# Altium project ece315-S20.PrjPcb
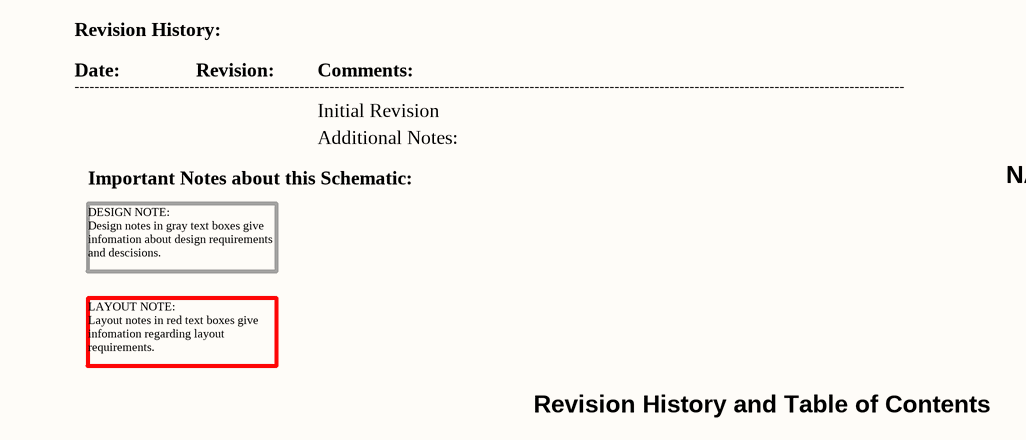
[diagram p0: 01-Revision_History_and_Contents.SchDoc]
9 sheets, 148 parts. Net scope: global (net labels, ports and power ports of the same name join across sheets).
Board file: ECE315_S20.PcbDoc
Sheets:
  01-Revision_History_and_Contents.SchDoc
  02-Power.SchDoc
  03_MCU.SchDoc
  04_LEDs.SchDoc
  05_LEDs.SchDoc
  06_LEDs.SchDoc
  07_Buzzer.SchDoc
  08_USB_To_UART.SchDoc
  09_Mechanicals.SchDoc

## Sheet 01-Revision_History_and_Contents.SchDoc: Revision History and Contents
size A; Date: 4/25/2017; ApprovedBy: JSK; CheckedBy: JSK; Author: JSK; CompanyName: University of Wisconsin; DrawnBy: JSK; Engineer: JSK; Organization: ECE 315; Address1: College of Engineering; Address2: 1415 Engineering Drive; Address3: Madison, WI 53706; Address4: ECE 453 Spring 2017; Revision: A; SheetNumber: 1; SheetTotal: 2

### Notes on the sheet
- Revision History:
- Date:
- ----------------------------------------------------------------------------------------------------------------------------------------------------------------------
- Revision:
- Comments:
- Initial Revision
- Important Notes about this Schematic:
- Additional Notes:
- NAME: Albert Liu
- DESIGN NOTE:
  Design notes in gray text boxes give infomation about design requirements and descisions.
- LAYOUT NOTE:
  Layout notes in red text boxes give infomation regarding layout requirements.
- Revision History and Table of Contents

## Sheet 02-Power.SchDoc: ECE315 Analog
size A; Date: 4/25/2017; ApprovedBy: JSK; CheckedBy: JSK; Author: JSK; CompanyName: University of Wisconsin; DrawnBy: JSK; Engineer: JSK; Organization: ECE 315; Address1: College of Engineering; Address2: 1415 Engineering Drive; Address3: Madison, WI 53706; Address4: ECE 315 Fall 2017; Revision: A; SheetNumber: 2; SheetTotal: 2; AssemblyNumber: ECE315-F19; ApprovedDate: 04/02/2019
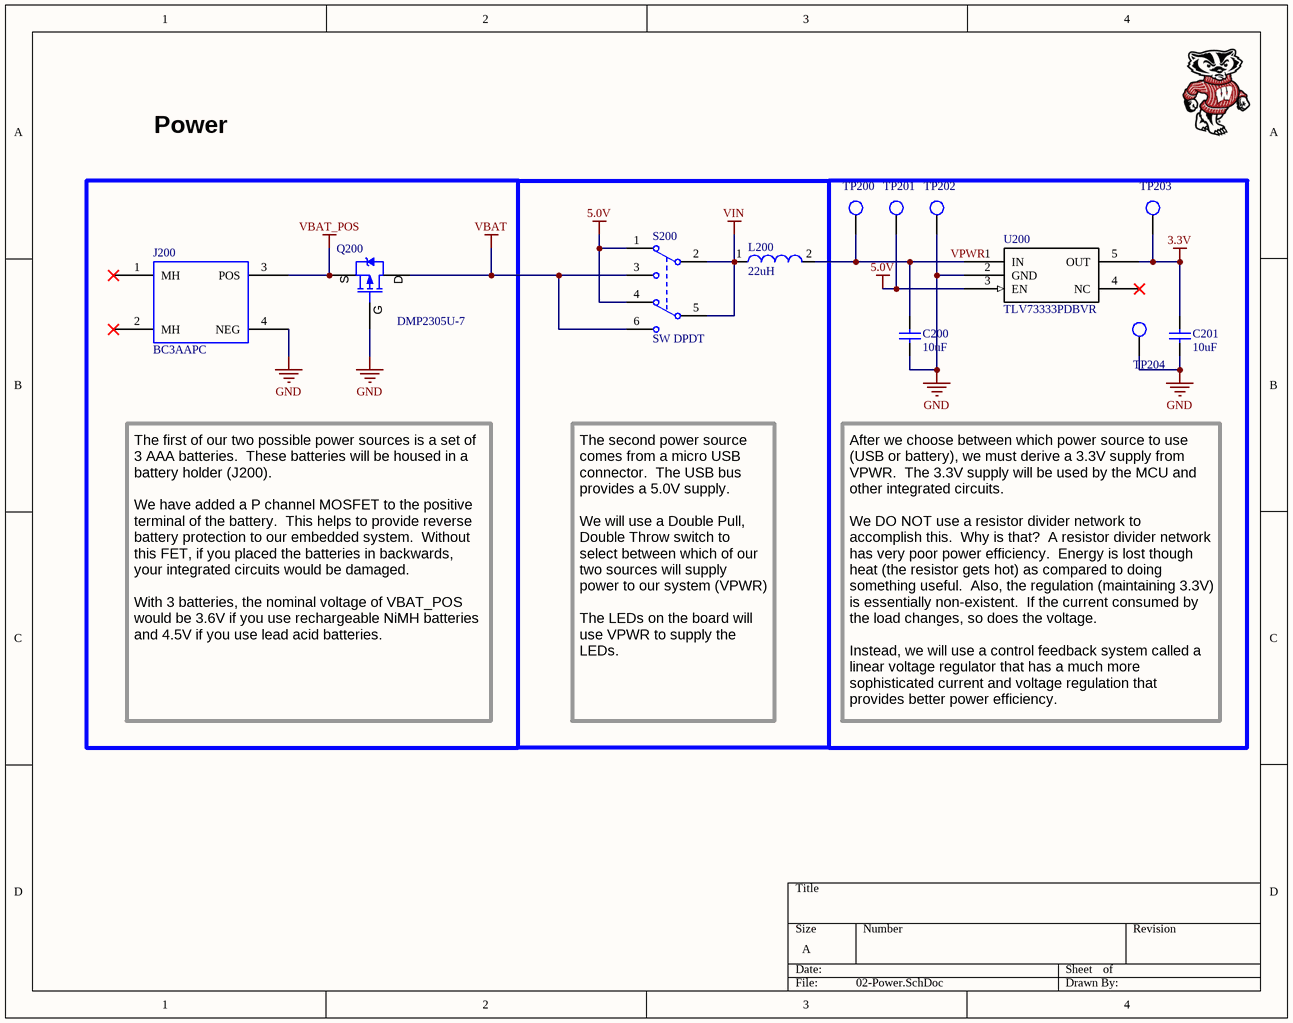
[diagram p1: 02-Power.SchDoc]

### Parts
C200  10uF  [CAP_0805]
C201  10uF  [CAP_0805]
J200  BC3AAPC  [BC3AAPC]
L200  Inductance: 22uH  [SRN3015]  (hidden comment: SRN3015-220M)
Q200  Manufacturer Part Number: DMP2305U-7  [SOT23]  (hidden comment: PMOS-DMP2305U-7)
S200  SW DPDT  [DPDT]
TP200  TP_1206  [TP-SMC-1206]  (value not drawn)
TP201  TP_1206  [TP-SMC-1206]  (value not drawn)
TP202  TP_1206  [TP-SMC-1206]  (value not drawn)
TP203  TP_1206  [TP-SMC-1206]  (value not drawn)
TP204  TP_1206  [TP-SMC-1206]  (value not drawn)
U200  Manufacturer Part Number: TLV73333PDBVR  [IC_TLV73333]  (hidden comment: IC-TLV733P)

### Nets
3.3V: C201.2 TP203.1 U200.5(OUT)
5.0V: S200.1(NC1) S200.4(NC2) TP201.1 U200.3(EN)
GND: C200.1 C201.1 J200.4(NEG) Q200.1(G) TP202.1 TP204.1 U200.2(GND)
VBAT: Q200.3(D) S200.3(NO1) S200.6(NO2)
VBAT_POS: J200.3(POS) Q200.2(S)
VIN: L200.1 S200.2(COMMON1) S200.5(COMMON2)
VPWR: C200.2 L200.2 TP200.1 U200.1(IN)

Not connected (* = marked no-connect by the designer): J200 1(MH)* 2(MH)*; U200 4(NC)*

### Notes on the sheet
- Power
- The first of our two possible power sources is a set of 3 AAA batteries.  These batteries will be housed in a battery holder (J200).
  We have added a P channel MOSFET to the positive terminal of the battery.  This helps to provide reverse battery protection to our embedded system.  Without this FET, if you placed the batteries in backwards, your integrated circuits would be damaged.
  With 3 batteries, the nominal voltage of VBAT_POS would be 3.6V if you use rechargeable NiMH batteries and 4.5V if you use lead acid batteries.
- The second power source comes from a micro USB connector.  The USB bus provides a 5.0V supply.
  We will use a Double Pull, Double Throw switch to select between which of our two sources will supply power to our system (VPWR)
  The LEDs on the board will use VPWR to supply the LEDs.
- After we choose between which power source to use (USB or battery), we must derive a 3.3V supply from VPWR.  The 3.3V supply will be used by the MCU and other integrated circuits.
  We DO NOT use a resistor divider network to accomplish this.  Why is that?  A resistor divider network has very poor power efficiency.  Energy is lost though heat (the resistor gets hot) as compared to doing something useful.  Also, the regulation (maintaining 3.3V) is essentially non-existent.  If the current consumed by the load changes, so does the voltage.
  Instead, we will use a control feedback system called a linear voltage regulator that has a much more sophisticated current and voltage regulation that provides better power efficiency.

### Library data of the parts
C200 C201 = CAP_0805_U_010.00: CAP CER 10UF 16V X7R 0805; Manufacturer: Samsung; Manufacturer Part Number: CL21A106KPCLQNC; Tolerance: 10%; Voltage Rating: 10V; Dielectric: X5R; ComponentLink3URL: https://datasheet.ciiva.com/26920/getdatasheetpartid-355170-26920201.pdf; ComponentLink3Description: https://datasheet.ciiva.com/26920/getdatasheetpartid-355170-26920201.pdf; Supplier 1: Digi-Key; Stock 1: 40000; Pricing 1: 1=0.22, 10=0.148, 100=0.0749, 500=0.05122, 1000=0.04531 (USD); Mount: Surface Mount; Case/Package: 0805; Case Code (Metric): 2012; Case Code (Imperial): 0805; Contact Plating: Tin; Min Operating Temperature: -55°C; Max Operating Temperature: 85°C; Packaging: Tape and Reel; Package Quantity: 1; Length: 2mm; Height: 0.85mm; Width: 0.049inch; Thickness: 0.037inch; Depth: 1.25mm; Radiation Hardening: No; ComponentLink1URL: https://datasheet.ciiva.com/25730/cl21a106kpclqnc-25730594.pdf; ComponentLink1Description: https://datasheet.ciiva.com/25730/cl21a106kpclqnc-25730594.pdf; Supplier Part Number 1: 1276-2402-1-ND; Capacitance: 10uF
J200 = BC3AAPC: BATTERY HOLDER AA 3 CELL PC PIN; Manufacturer: Memory Protection Devices; Number of Cells: 3; Package Quantity: 100; Termination: PC Pin; Min Operating Temperature: -10°C; Supplier: Digi-Key; Max Operating Temperature: 100°C; Mount: Through Hole,PCB; ComponentLink1URL: http://www.memoryprotectiondevices.com/datasheets/BC3AAPC-datasheet.pdf?src-supplier=Digi-Key; ComponentLink1Description: http://www.memoryprotectiondevices.com/datasheets/BC3AAPC-datasheet.pdf?src-supplier=Digi-Key; Supplier Part Number: BC3AAPC-ND; Manufacturer Part Number: BC3AAPC
L200 = SRN3015-220M: 22uH 3x3mm sheilded inductor 600mA; Manufacturer 1: Bourns; Core Material: Ferrite; Saturation Current: 580mA; Tolerance: 20%; Shielding: Shielded; Self Resonant Frequency: 28MHz; DC Resistance (DCR): 622mR; Test Frequency: 1MHz; Supplier 1: Digi-Key; Stock 1: 46536; Pricing 1: 1=0.46000, 10=0.40300, 100=0.28750, 500=0.24150, 1000=0.19550 (USD); RoHS: Yes; Case/Package: 1212; Number of Pins: 2; Weight: 0.001235oz; Contact Plating: Tin; Min Operating Temperature: -40°C; Max Operating Temperature: 125°C; Package Quantity: 2000; Inductance Tolerance: 20%; Packaging: Tape and Reel; Current Rating: 600mA; Composition: Wirewound; Max DC Current: 600mA; Termination: SMD/SMT; DC Current: 600mA; Military Standard: Not; RMS Current (Irms): 600mA; Length: 3.1mm; Height: 1.5mm; Width: 0.118inch; Height - Seated (Max): 0.059inch; Depth: 3.1mm; REACH SVHC: No SVHC; ComponentLink1URL: https://datasheet.ciiva.com/11802/0900766b80fe1f40-11802602.pdf?src-supplier=RSComponents; ComponentLink1Description: https://datasheet.ciiva.com/11802/0900766b80fe1f40-11802602.pdf?src-supplier=RSComponents; ComponentLink2URL: https://datasheet.ciiva.com/1048/srn3015-1048848.pdf?src-supplier=Digi-Key; ComponentLink2Description: https://datasheet.ciiva.com/1048/srn3015-1048848.pdf?src-supplier=Digi-Key; ComponentLink3URL: https://datasheet.ciiva.com/1048/srn3015-1048849.pdf?src-supplier=Digi-Key; ComponentLink3Description: https://datasheet.ciiva.com/1048/srn3015-1048849.pdf?src-supplier=Digi-Key; ComponentLink4URL: https://datasheet.ciiva.com/1048/srn3015-1048850.pdf?src-supplier=Digi-Key; ComponentLink4Description: https://datasheet.ciiva.com/1048/srn3015-1048850.pdf?src-supplier=Digi-Key; ComponentLink5URL: https://datasheet.ciiva.com/30089/587srn3015-30089590.pdf?src-supplier=Onlinecomponents.com; ComponentLink5Description: https://datasheet.ciiva.com/30089/587srn3015-30089590.pdf?src-supplier=Onlinecomponents.com; ComponentLink6URL: https://datasheet.ciiva.com/7849/1481208-7849511.pdf?src-supplier=Element14; ComponentLink6Description: https://datasheet.ciiva.com/7849/1481208-7849511.pdf?src-supplier=Element14; ComponentLink7URL: https://datasheet.ciiva.com/22678/1875284-22678991.pdf?src-supplier=Element14; ComponentLink7Description: https://datasheet.ciiva.com/22678/1875284-22678991.pdf?src-supplier=Element14; Manufacturer Part Number 1: SRN3015-220M; Supplier Part Number 1: SRN3015-220MCT-ND
Q200 = PMOS-DMP2305U-7: MOSFET P-CH 20V 4.2A SOT-23; Manufacturer: Diodes Zetex; Turn-Off Delay Time: 53.8ns; Drain to Source Breakdown Voltage: -20V; Number of Channels: 1; On-State Resistance: 60mR; Power Dissipation: 1.4W; Input Capacitance: 727pF; Turn-On Delay Time: 14ns; Rise Time: 13ns; Gate to Source Voltage (Vgs): 8V; Element Configuration: Single; Threshold Voltage: -500mV; ComponentLink1Description: Manufacturer Link; ComponentLink1URL: http://www.irf.com/; ComponentLink2URL: http://www.diodes.com/_files/datasheets/ds30149.pdf?src-supplier=Future+Electronics; ComponentLink2Description: http://www.diodes.com/_files/datasheets/ds30149.pdf?src-supplier=Future+Electronics; ComponentLink3URL: http://www.diodes.com/datasheets/ds31737.pdf?src-supplier=Avnet+Asia; ComponentLink3Description: http://www.diodes.com/datasheets/ds31737.pdf?src-supplier=Avnet+Asia; Contact Plating: Tin,Matte; Weight: 0.000282oz; Continuous Drain Current (ID): 4.2A; Min Operating Temperature: -55°C; Number of Elements: 1; Mount: Surface Mount; Number of Pins: 3; REACH SVHC: No SVHC; Radiation Hardening: No; Length: 2.9mm; Drain to Source Voltage (Vdss): 20V; Case/Package: SOT-23; Rds On Max: 60mR; Lead Free: Lead Free; Packaging: Tape and Reel; Fall Time: 13ns; Max Power Dissipation: 1.4W; Drain to Source Resistance: 60mR; Max Operating Temperature: 150°C; Width: 1.3mm; Package Quantity: 3000; Supplier: Digi-Key; Height: 1mm; Supplier Part Number: DMP2305UDICT-ND
S200 = SW DPDT: Switch; Manufacturer: ITT /  C&K Components; Manufacturer Part Number: JS202011SCQN; Actuator Color: Black; Maximum DC Voltage Rating: 6 V; Actuator Material: Nylon 4/6; Electrical Life: 15000 Cycles; Body Orientation: Straight; Maximum Contact Resistance: 70 mOhm; Actuator Style: Top Slide; Dielectric Strength: 500 VAC; Minimum Insulation Resistance: 100 MOhm; Contact Rating @ Voltage: 0.3@6VDC A; COO: US; Published: 24-Mar-1999; LatestRevisionDate: 29-May-2009; LatestRevisionNote: IPC-7351 Footprint Added.; PackageVersion: Mar-2001; PackageReference: SOT23-6; Publisher: Altium Limited; PackageDescription: 6-Pin SOT-23 Package 0.95 mm Pitch, 2.7 mm Lead Span; Code_JEITA: SC-74; Code_IPC: SOT26A-6; Supplier 1: C&K Components; Stock 1: 22661; Pricing 1: 1=0.46, 10=0.441, 25=0.4316, 50=0.3858, 100=0.3674, 250=0.3582, 500=0.3031 (USD); Part No: JS202011SCQN; RoHS: Yes; Supplier Standard Pack: 5,000; Type: Sub-Miniature; Maximum AC Voltage Rating: N/A; Family: JS; Contact Material: Copper Alloy; Seal Description: N/A; Pole Throw Configuration: DPDT; Mechanical Life: N/A; Packaging: Tape and Reel; Contact Plating: Silver; Switch Configuration: N/A; Housing Material: Nylon 4/6; Product Weight: N/A; Base Material: N/A; Mounting: Surface Mount,Gull Wing; Seal Location: N/A; Operating Temperature: -40 to 85 C; Dimension: 9 x 7.5 x 5.5 mm; HTS: 8536509050; ECCN: EAR99; ComponentLink1URL: https://datasheet.ciiva.com/23829/1707718-23829488.pdf; ComponentLink1Description: https://datasheet.ciiva.com/23829/1707718-23829488.pdf; ComponentLink2URL: https://datasheet.ciiva.com/2889/js-29aug13-2889127.pdf; ComponentLink2Description: https://datasheet.ciiva.com/2889/js-29aug13-2889127.pdf; ComponentLink3URL: https://datasheet.ciiva.com/2889/js-15sept15-2889128.pdf; ComponentLink3Description: https://datasheet.ciiva.com/2889/js-15sept15-2889128.pdf; ComponentLink4URL: https://datasheet.ciiva.com/2889/js-15sept15-2889129.pdf; ComponentLink4Description: https://datasheet.ciiva.com/2889/js-15sept15-2889129.pdf; ComponentLink5URL: https://datasheet.ciiva.com/22630/1707718-22630697.pdf; ComponentLink5Description: https://datasheet.ciiva.com/22630/1707718-22630697.pdf; ComponentLink6URL: https://datasheet.ciiva.com/8625/js-9dec14-8625470.pdf; ComponentLink6Description: https://datasheet.ciiva.com/8625/js-9dec14-8625470.pdf; Supplier Part Number 1: 401-2002-1-ND
TP200-TP204 = TP_1206: Test Point SMD 1206; Manufacturer: TE Connectivity (Tyco Electronics); Manufacturer Part Number: 1625854-1; Resistance Value: 0 Ohm; Temperature Coefficient: N/R; Supplier 1: Digi-Key; Stock 1: 31937; Pricing 1: 1=0.28, 10=0.261, 25=0.224, 50=0.1902, 100=0.1828, 250=0.1641, 500=0.1567, 1000=0.1306 (USD); Case Size: 1206; Dimension: 3.2 x 1.6 x 1.25mm; Family: RC; Mounting: Surface Mount; Operating Temperature: -55 to 125 C; Part No: 1625854-1; RoHS: Yes; Packaging: Tape and Reel; Termination Style: N/R; Terminal Pitch: N/R; Power Rating: N/R; Tolerance: N/R; ComponentLink1URL: https://datasheet.ciiva.com/6439/eng-ds-1773266-a-6439169.pdf; ComponentLink1Description: https://datasheet.ciiva.com/6439/eng-ds-1773266-a-6439169.pdf; ComponentLink2URL: https://datasheet.ciiva.com/30136/1773266-a-30136341.pdf; ComponentLink2Description: https://datasheet.ciiva.com/30136/1773266-a-30136341.pdf; ComponentLink3URL: https://datasheet.ciiva.com/6439/eng-ds-1773266-a-6439080.pdf; ComponentLink3Description: https://datasheet.ciiva.com/6439/eng-ds-1773266-a-6439080.pdf; ComponentLink4URL: https://datasheet.ciiva.com/6439/eng-ds-1773266-a-6439081.pdf; ComponentLink4Description: https://datasheet.ciiva.com/6439/eng-ds-1773266-a-6439081.pdf; ComponentLink5URL: https://datasheet.ciiva.com/6439/eng-ds-1773266-a-6439083.pdf; ComponentLink5Description: https://datasheet.ciiva.com/6439/eng-ds-1773266-a-6439083.pdf; Supplier Part Number 1: A106143CT-ND
U200 = IC-TLV733P: IC REG LINEAR 3.3V 300MA SOT23-5; Manufacturer: Texas Instruments; Number of Outputs: 1; Min Input Voltage: 1.4V; Max Input Voltage: 5.5V; Dropout Voltage: 125mV; Min Current Limit: 360mA; Polarity: Positive; Quiescent Current: 60uA; Accuracy: 1%; Supplier 1: Digi-Key; Stock 1: 44968; Pricing 1: 1=0.46, 10=0.373, 100=0.2538, 500=0.19034, 1000=0.14276 (USD); Mount: Surface Mount; Case/Package: SOT-23-5; Number of Pins: 5; Weight: 0.000557oz; Contact Plating: Nickel,Gold; Min Operating Temperature: -40°C; Max Operating Temperature: 125°C; Packaging: Tape and Reel; Max Output Current: 300mA; Output Voltage: 3.3V; Output Current: 300mA; Number of Regulators: 1; Package Quantity: 3000; Radiation Hardening: No; Lead Free: Lead Free; ComponentLink1URL: https://datasheet.ciiva.com/48677/tlv733p-48677542.pdf; ComponentLink1Description: https://datasheet.ciiva.com/48677/tlv733p-48677542.pdf; Supplier Part Number 1: 296-40673-1-ND

## Sheet 03_MCU.SchDoc: ECE315 MCU
size A; Date: 4/25/2017; ApprovedBy: JSK; CheckedBy: JSK; Author: JSK; CompanyName: University of Wisconsin; DrawnBy: JSK; Engineer: JSK; Organization: ECE 315; Address1: College of Engineering; Address2: 1415 Engineering Drive; Address3: Madison, WI 53706; Address4: ECE 315 Fall 2017; Revision: A; SheetNumber: 3; SheetTotal: 6; AssemblyNumber: ECE315-F19; ApprovedDate: 04/02/2019
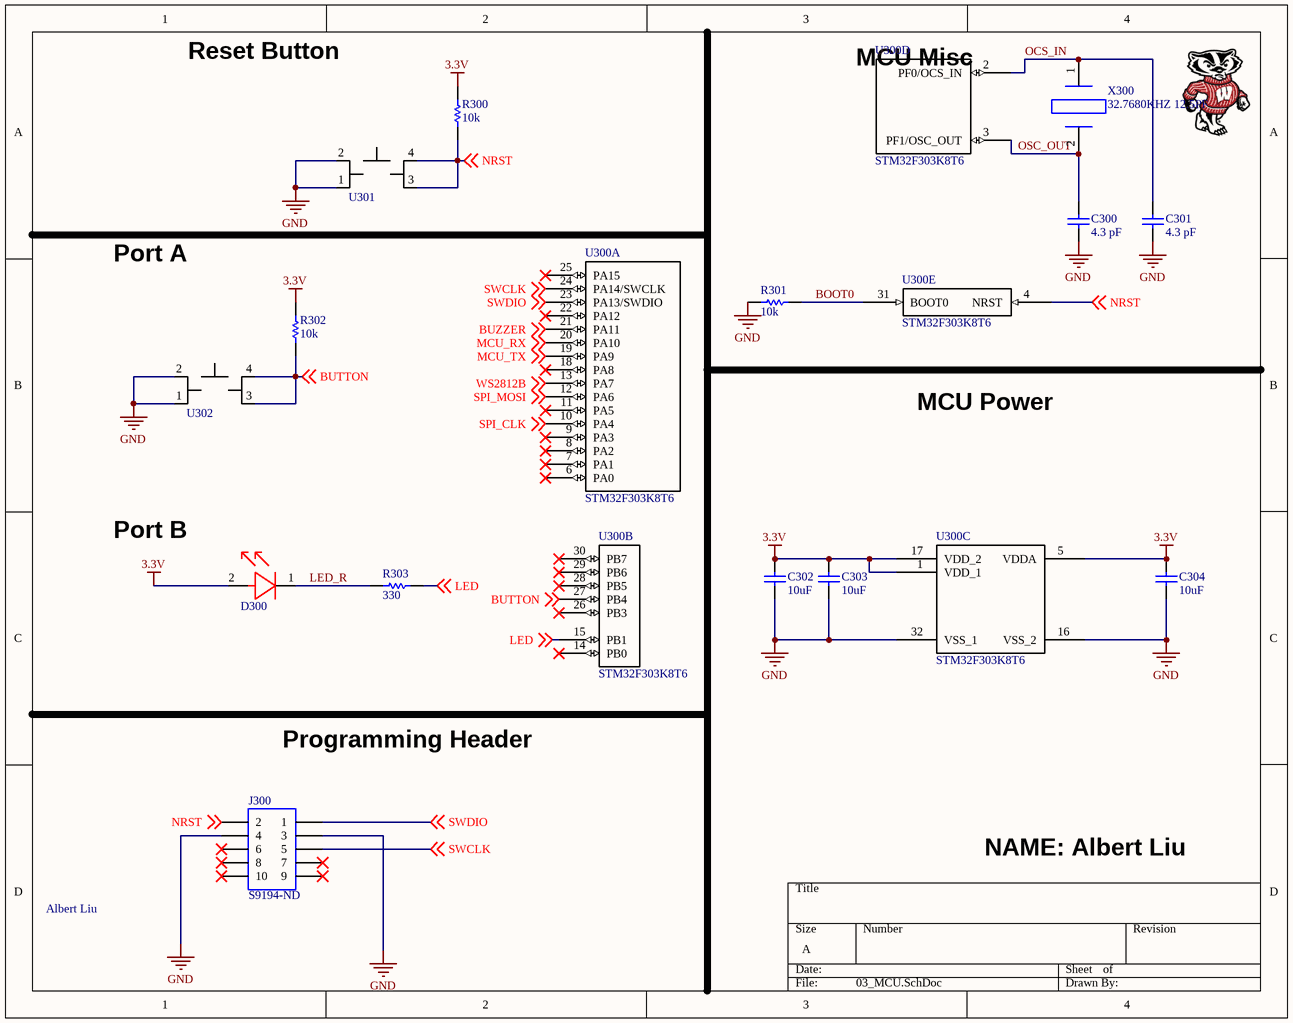
[diagram p2: 03_MCU.SchDoc]

### Parts
C300  Capacitance Value: 4.3 pF  [CAP_0805]  (hidden comment: CAP_0805_P_004.30)
C301  Capacitance Value: 4.3 pF  [CAP_0805]  (hidden comment: CAP_0805_P_004.30)
C302  10uF  [CAP_0805]
C303  10uF  [CAP_0805]
C304  10uF  [CAP_0805]
D300  LED_RED_0805.1  [LED_RED_0805]  (value not drawn)
J300  Supplier Part Number 1: S9194-ND  [SFH11-PBPC-D05-ST-BK]  (hidden comment: SFH11-PBPC-D05-ST-BK)
R300  10K  [RES_0805]
R301  10K  [RES_0805]
R302  10K  [RES_0805]
R303  330  [RES_0805]
U300  Manufacturer Part Number: STM32F303K8T6  [LQFP32]  (hidden comment: IC_STM32F303K8T6)  (parts A,B,C,D,E of 5)
U301  SWITCH_6mm_6mm_smd  [SWITCH_6mm_6mm_smd]  (value not drawn)
U302  SWITCH_6mm_6mm_smd  [SWITCH_6mm_6mm_smd]  (value not drawn)
X300  32.7680KHZ 12.5PF  [NX3215SA-32.768K-STD-MUA-8]

### Nets
3.3V: C302.2 C303.2 C304.2 D300.2(Anode) R300.2 R302.2 U300.1(VDD_1) U300.5(VDDA) U300.17(VDD_2)
GND: C300.1 C301.1 C302.1 C303.1 C304.1 J300.3 J300.4 R301.1 U300.16(VSS_2) U300.32(VSS_1) U301.1 U301.2 U302.1 U302.2
BOOT0: R301.2 U300.31(BOOT0)
BUTTON: R302.1 U300.27(PB4) U302.3 U302.4(VCCIO) ; off-sheet BUTTON
BUZZER: U300.21(PA11) ; off-sheet BUZZER
LED: R303.2 U300.15(PB1) ; off-sheet LED
LED_R: D300.1(Cathode) R303.1
MCU_RX: U300.20(PA10) ; off-sheet MCU_RX
MCU_TX: U300.19(PA9) ; off-sheet MCU_TX
NRST: J300.2 R300.1 U300.4(NRST) U301.3 U301.4(VCCIO) ; off-sheet NRST
OCS_IN: C301.2 U300.2(PF0/OCS_IN) X300.1
OSC_OUT: C300.2 U300.3(PF1/OSC_OUT) X300.2
SPI_CLK: U300.10(PA4) ; off-sheet SPI_CLK
SPI_MOSI: U300.12(PA6) ; off-sheet SPI_MOSI
SWCLK: J300.5 U300.24(PA14/SWCLK) ; off-sheet SWCLK
SWDIO: J300.1 U300.23(PA13/SWDIO) ; off-sheet SWDIO
WS2812B: U300.13(PA7) ; off-sheet WS2812B

Not connected (* = marked no-connect by the designer): J300 6* 7* 8* 9* 10*; U300 6(PA0)* 7(PA1)* 8(PA2)* 9(PA3)* 11(PA5)* 14(PB0)* 18(PA8)* 22(PA12)* 25(PA15)* 26(PB3)* 28(PB5)* 29(PB6)* 30(PB7)*

### Notes on the sheet
- Reset Button
- MCU Misc
- Port A
- MCU Power
- Port B
- Programming Header
- Albert Liu
- NAME: Albert Liu

### Library data of the parts
C300 C301 = CAP_0805_P_004.30: CAP CER 4.3PF 100V NP0 0805; Manufacturer: Kyocera AVX; Manufacturer Part Number: 08051A4R3CAT2A; Rad Hard: No; Voltage: 100 Vdc; Tolerance: 0.25 pF; Dielectric: C0G; Product Length: 2.01 mm; Product Depth: 1.25 mm; Supplier 1: Digi-Key; Stock 1: 23910; Pricing 1: 1=0.24, 10=0.167, 100=0.0946, 500=0.0668, 1000=0.0584 (USD); Packaging: Tape & Reel; Package/Case: 0805; Mounting: Surface Mount; Operating Temperature: -55 to 125 °C; Construction: Flat; Category: Capacitor Ceramic Multilayer; ComponentLink1URL: https://datasheet.ciiva.com/204/ccog-204944.pdf; ComponentLink1Description: https://datasheet.ciiva.com/204/ccog-204944.pdf; ComponentLink2URL: https://datasheet.ciiva.com/11570/ccog-11570969.pdf; ComponentLink2Description: https://datasheet.ciiva.com/11570/ccog-11570969.pdf; Supplier Part Number 1: 478-10404-1-ND
C302-C304 = CAP_0805_U_010.00: as C200 on sheet 02-Power; ComponentLink3URL: https://datasheet.ciiva.com/26920/getdatasheetpartid-355170-26920201.pdf; ComponentLink3Description: https://datasheet.ciiva.com/26920/getdatasheetpartid-355170-26920201.pdf; Supplier 1: Digi-Key; Stock 1: 40000; Pricing 1: 1=0.22, 10=0.148, 100=0.0749, 500=0.05122, 1000=0.04531 (USD); Mount: Surface Mount; Case/Package: 0805; Case Code (Metric): 2012; Case Code (Imperial): 0805; Contact Plating: Tin; Min Operating Temperature: -55°C; Max Operating Temperature: 85°C; Packaging: Tape and Reel; Package Quantity: 1; Length: 2mm; Height: 0.85mm; Width: 0.049inch; Thickness: 0.037inch; Depth: 1.25mm; Radiation Hardening: No; ComponentLink1URL: https://datasheet.ciiva.com/25730/cl21a106kpclqnc-25730594.pdf; ComponentLink1Description: https://datasheet.ciiva.com/25730/cl21a106kpclqnc-25730594.pdf; Supplier Part Number 1: 1276-2402-1-ND; Capacitance: 10uF
D300 = LED_RED_0805.1: LED SUPER RED CLR THIN 0805 SMD; Manufacturer: Vishay / Lite-On; Manufacturer Part Number: LTST-C171KRKT; Chip Material: AlGaInP; DELETED: Compliant; Dominant Wave Length: 631 nm; Forward Current: 30 mA; Forward Voltage: 2.4 V; High Brightness: Yes; Lum Intensity: 54mcd; Main Category: Chip LED; Number of  Elements: 1; Peak Wavelength: 639 nm; Power Dissipation: 75 W; Product Depth (mm): 1.25 mm; Product Height (mm): 0.8 mm; Product Length (mm): 2 mm; Rad Hardened: No; Reverse Voltage: 5 V; Shape Type: Rectangular; Test Current (It): 20 mA; Type: Uni-Color; Viewing Angle: 130 deg; Supplier 1: Digikey; Stock 1: 97347; Pricing 1: 1=0.31, 10=0.225, 25=0.1656, 100=0.1183, 250=0.0804, 500=0.071, 1000=0.0556 (USD); Emitting Color: Red; Lens Dimensions: 1.4x1.25x0.5 mm; Luminous Intensity: 54mcd; Mounting: Surface Mount; Operating Temp Range: -55C to 85C; Operating Temperature Classification: Industrial; Package Type: Chip Led; Packaging: Tape and Reel; Pin Count: 2; ComponentLink1URL: https://datasheet.ciiva.com/2110/s-110-ltst-c171krkt-2110066.pdf; ComponentLink1Description: https://datasheet.ciiva.com/2110/s-110-ltst-c171krkt-2110066.pdf; ComponentLink2URL: https://datasheet.ciiva.com/2110/s-110-ltst-c171krkt-2110067.pdf; ComponentLink2Description: https://datasheet.ciiva.com/2110/s-110-ltst-c171krkt-2110067.pdf; ComponentLink3URL: https://datasheet.ciiva.com/2110/s-110-ltst-c171krkt-2110068.pdf; ComponentLink3Description: https://datasheet.ciiva.com/2110/s-110-ltst-c171krkt-2110068.pdf; ComponentLink4URL: https://datasheet.ciiva.com/12403/lite-on-ltst-c171krkt-187201-12403781.pdf; ComponentLink4Description: https://datasheet.ciiva.com/12403/lite-on-ltst-c171krkt-187201-12403781.pdf; ComponentLink5URL: https://datasheet.ciiva.com/11775/0900766b80dc0299-11775643.pdf; ComponentLink5Description: https://datasheet.ciiva.com/11775/0900766b80dc0299-11775643.pdf; ComponentLink6URL: https://datasheet.ciiva.com/16444/lite-on20ltst-c171krkt-16444779.pdf; ComponentLink6Description: https://datasheet.ciiva.com/16444/lite-on20ltst-c171krkt-16444779.pdf; Supplier Part Number 1: 160-1427-1-ND
J300 = SFH11-PBPC-D05-ST-BK: CONN HDR 10POS 0.1 GOLD PCB; Manufacturer 1: Sullins; Number of Positions: 10; Connector Type: Header; Pitch: 0.1inch; Supplier 1: Digi-Key; Manufacturer Part Number 1: SFH11-PBPC-D05-ST-BK; Stock 1: 26289; Pricing 1: 1=0.66000, 10=0.57600, 100=0.49700, 500=0.40662, 1000=0.36144, 5000=0.32630 (USD); RoHS: Yes; Mount: Through Hole; Color: Black; Contact Plating: Gold; Package Quantity: 1; Number of Rows: 2; Packaging: Tray; Termination: Solder; Row Spacing: 0.1inch; Lead Free: Lead Free; ComponentLink1URL: https://datasheet.ciiva.com/754/sfh11-pxxc-dxx-st-xx11160-c-754555.pdf?src-supplier=Digi-Key; ComponentLink1Description: https://datasheet.ciiva.com/754/sfh11-pxxc-dxx-st-xx11160-c-754555.pdf?src-supplier=Digi-Key
R300-R302 = RES_0805_K_010.00: RES SMD 10K OHM 1% 1/8W 0805; Manufacturer: Panasonic / Panasonic ECG; Manufacturer Part Number: ERJ-6ENF1002V; Power Rating: 125mW; Temperature Coefficient: ± 200ppm/°C; Voltage Rating: 150V; Resistor Element Material: Thick Film; Resistor Case Style: 0805; No. of Pins: 2; Product Range: PANASONIC - ERJ Series; Supplier 1: Digikey; Stock 1: 87; Pricing 1: 1=0.1, 10=0.041, 100=0.0167, 1000=0.0075, 2500=0.0065 (USD); Series: ERJ; Supplier Part Number 1: P10.0KCCT-ND; Resistance: 10k; Resistance Tolerance: ± 1%; Resistor Mounting: SMD; Resistor Element Type: Thick Film; ComponentLink1URL: https://datasheet.ciiva.com/11808/0900766b80f80784-11808080.pdf; ComponentLink1Description: https://datasheet.ciiva.com/11808/0900766b80f80784-11808080.pdf; ComponentLink2URL: https://datasheet.ciiva.com/16514/aoa0000ce2-16514021.pdf; ComponentLink2Description: https://datasheet.ciiva.com/16514/aoa0000ce2-16514021.pdf; ComponentLink3URL: https://datasheet.ciiva.com/27055/1988971-27055733.pdf; ComponentLink3Description: https://datasheet.ciiva.com/27055/1988971-27055733.pdf; ComponentLink4URL: https://datasheet.ciiva.com/16759/70260748-16759350.pdf; ComponentLink4Description: https://datasheet.ciiva.com/16759/70260748-16759350.pdf; ComponentLink5URL: https://datasheet.ciiva.com/16725/70260748-16725031.pdf; ComponentLink5Description: https://datasheet.ciiva.com/16725/70260748-16725031.pdf; ComponentLink6URL: https://datasheet.ciiva.com/7830/426256-7830745.pdf; ComponentLink6Description: https://datasheet.ciiva.com/7830/426256-7830745.pdf; ComponentLink7URL: https://datasheet.ciiva.com/46372/1678782-46372714.pdf; ComponentLink7Description: https://datasheet.ciiva.com/46372/1678782-46372714.pdf; ComponentLink8URL: https://datasheet.ciiva.com/46372/1678782-46372715.pdf; ComponentLink8Description: https://datasheet.ciiva.com/46372/1678782-46372715.pdf; ComponentLink9URL: https://datasheet.ciiva.com/17212/aoa0000ce2-17212108.pdf; ComponentLink9Description: https://datasheet.ciiva.com/17212/aoa0000ce2-17212108.pdf; ComponentLink10URL: https://datasheet.ciiva.com/30140/aoa0000ce2-30140236.pdf; ComponentLink10Description: https://datasheet.ciiva.com/30140/aoa0000ce2-30140236.pdf; ComponentLink11URL: https://datasheet.ciiva.com/16740/aoa0000ce2-16740669.pdf; ComponentLink11Description: https://datasheet.ciiva.com/16740/aoa0000ce2-16740669.pdf; ComponentLink12URL: https://datasheet.ciiva.com/24070/aoa0000ce2-24070702.pdf; ComponentLink12Description: https://datasheet.ciiva.com/24070/aoa0000ce2-24070702.pdf
R303 = RES_0805_R_330.00: RES SMD 330 OHM 1% 1/8W 0805; Manufacturer: Panasonic / Panasonic ECG; Manufacturer Part Number: ERJ-6ENF3300V; Temperature Coefficient: ± 200ppm/°C; Voltage Rating: 150V; SVHC: To Be Advised; Product Range: PANASONIC - ERJ Series; Power Rating: 125mW; Resistor Case Style: 0805 ^2012 Metric]; Resistor Element Type: Thick Film; Supplier 1: Digikey; Stock 1: 233511; Pricing 1: 1=0.1, 10=0.041, 100=0.0167, 1000=0.0075, 2500=0.0065 (USD); Packaging: Full Reel; Resistance Tolerance: ± 1%; ComponentLink1URL: https://datasheet.ciiva.com/11821/0900766b80f80784-11821635.pdf; ComponentLink1Description: https://datasheet.ciiva.com/11821/0900766b80f80784-11821635.pdf; ComponentLink2URL: https://datasheet.ciiva.com/30131/aoa0000ce2-30131349.pdf; ComponentLink2Description: https://datasheet.ciiva.com/30131/aoa0000ce2-30131349.pdf; ComponentLink3URL: https://datasheet.ciiva.com/24025/aoa0000ce2-24025991.pdf; ComponentLink3Description: https://datasheet.ciiva.com/24025/aoa0000ce2-24025991.pdf; ComponentLink4URL: https://datasheet.ciiva.com/17206/aoa0000ce2-17206152.pdf; ComponentLink4Description: https://datasheet.ciiva.com/17206/aoa0000ce2-17206152.pdf; ComponentLink5URL: https://datasheet.ciiva.com/46436/1678782-46436633.pdf; ComponentLink5Description: https://datasheet.ciiva.com/46436/1678782-46436633.pdf; ComponentLink6URL: https://datasheet.ciiva.com/46436/1678782-46436634.pdf; ComponentLink6Description: https://datasheet.ciiva.com/46436/1678782-46436634.pdf; ComponentLink7URL: https://datasheet.ciiva.com/16760/70260748-16760668.pdf; ComponentLink7Description: https://datasheet.ciiva.com/16760/70260748-16760668.pdf; ComponentLink8URL: https://datasheet.ciiva.com/16780/70260748-16780764.pdf; ComponentLink8Description: https://datasheet.ciiva.com/16780/70260748-16780764.pdf; ComponentLink9URL: https://datasheet.ciiva.com/22684/1678782-22684798.pdf; ComponentLink9Description: https://datasheet.ciiva.com/22684/1678782-22684798.pdf; ComponentLink10URL: https://datasheet.ciiva.com/28590/1678782-28590783.pdf; ComponentLink10Description: https://datasheet.ciiva.com/28590/1678782-28590783.pdf; Supplier Part Number 1: P330CCT-ND; Resistance: 330
U300 = IC_STM32F303K8T6: ARM® Cortex®-M4 STM32 F3 Microcontroller IC 32-Bit 72MHz 64KB (64K x 8) FLASH 32-LQFP (7x7); Manufacturer: STMicroelectronics; Connectivity: CAN, I²C, IrDA, LIN, SPI, UART/USART; Peripherals: DMA, I²S, POR, PWM, WDT; Number of I/O: 10; RAM Size: 12K x 8; Voltage - Supply (Vcc/Vdd): 2 V ~ 3.6 V; Data Converters: A/D 9x12b, D/A 3x12b; Oscillator Type: Internal; Supplier 1: Digikey; Stock 1: 848; Pricing 1: 1=4.28, 10=3.846, 100=3.1512, 500=2.6826, 1000=2.2624 (USD); Category: Integrated Circuits (ICs); Family: Embedded - Microcontrollers; Series: STM32 F3; Packaging: Tray; Core Processor: ARM® Cortex®-M4; Core Size: 32-Bit; Speed: 72MHz; Program Memory Size: 64KB (64K x 8); Program Memory Type: FLASH; EEPROM Size: -; Operating Temperature: -40°C ~ 85°C (TA); Package / Case: 32-LQFP; Supplier Device Package: 32-LQFP (7x7); ComponentLink1URL: http://www.st.com/web/en/resource/technical/document/datasheet/DM00092070.pdf; ComponentLink1Description: http://www.st.com/web/en/resource/technical/document/datasheet/DM00092070.pdf; Supplier Part Number 1: 497-15828-ND
U301 U302 = SWITCH_6mm_6mm_smd: SWITCH TACTILE SPST-NO 0.05A 12V; Manufacturer: C&K Components; Manufacturer Part Number: PTS645SH50SMTR92 LFS; Operating Force: 200gf; Illumination: Non-Illuminated; Switch Function: Off-Mom; Actuator Height off PCB, from Pins: 5.00mm; Actuator Type: Standard; Actuator Material: Polyamide (PA66), Nylon 6/6; Contact Rating @ Voltage: 0.05A @ 12VDC; Actuator Orientation: Top Actuated; Outline: 6.00mm x 6.00mm; Mechanical Life: 100,000 Cycles; Illumination Type, Color: -; Packaging: Tape & Reel (TR); Illumination Voltage (Nominal): -; Ingress Protection: -; Switch Travel: -; Category: Switches; Circuit: SPST-NO; Supplier: Digi-Key; Termination Style: Gull Wing; Features: -; Mounting Type: Surface Mount; Operating Temperature: -20°C ~ 60°C; RoHS: RoHS Compliant; Supplier Part Number: CKN9085TR-ND; Supplier 1: Digi-Key; Supplier Part Number 1: CKN9085CT-ND
X300 = CRYSTAL_NX3215SA-32.768K: CRYSTAL 32.768KHZ 12.5PF SMD; Manufacturer: Nihon Dempa Kogyo (NDK); Catalog Drawings: NX3215SA Series Top / NX3215SA Series Side / NX3215SA Series Bottom / NX3215SA Series Circuit; Featured Product: NX3215SA Series 32.768KHz SMD Crystals; Frequency Tolerance: ±20ppm; ESR (Equivalent Series Resistance): 70 kOhm; Operating Mode: Fundamental; Dynamic Catalog: NX3215SA Series; Other Names: 644-1156-6; Supplier 1: Digikey; Stock 1: 45314; Pricing 1: 1=0.94, 10=0.835, 50=0.7804, 100=0.6897, 500=0.6534, 1000=0.5445 (USD); Standard Package: 1; Category: Crystals and Oscillators; Family: Crystals; Series: NX3215SA; Type: kHz Crystal (Tuning Fork); Frequency: 32.768kHz; Load Capacitance: 12.5pF; Operating Temperature: -40°C ~ 85°C; Mounting Type: Surface Mount; Package / Case: 2-SMD; Size / Dimension: 0.126" L x 0.059" W (3.20mm x 1.50mm); Height: 0.035" (0.90mm); Packaging: Digi-Reel®; ComponentLink1URL: https://datasheet.ciiva.com/857/c-nx3215sa-std-mua-9-e-857050.pdf; ComponentLink1Description: https://datasheet.ciiva.com/857/c-nx3215sa-std-mua-9-e-857050.pdf; ComponentLink2URL: https://datasheet.ciiva.com/857/c-nx3215sa-std-mua-9-e-857051.pdf; ComponentLink2Description: https://datasheet.ciiva.com/857/c-nx3215sa-std-mua-9-e-857051.pdf; ComponentLink3URL: https://datasheet.ciiva.com/857/c-nx3215sa-std-mua-9-e-857052.pdf; ComponentLink3Description: https://datasheet.ciiva.com/857/c-nx3215sa-std-mua-9-e-857052.pdf; Supplier Part Number 1: 644-1156-1-ND; Manufacturer Part Number: NX3215SA-32.768K-STD-MUA-8

## Sheet 04_LEDs.SchDoc: ECE315 Analog
size A; Date: 4/25/2017; ApprovedBy: JSK; CheckedBy: JSK; Author: JSK; CompanyName: University of Wisconsin; DrawnBy: JSK; Engineer: JSK; Organization: ECE 315; Address1: College of Engineering; Address2: 1415 Engineering Drive; Address3: Madison, WI 53706; Address4: ECE 315 Fall 2017; Revision: A; SheetNumber: 2; SheetTotal: 2; AssemblyNumber: ECE315-F19; ApprovedDate: 04/02/2019
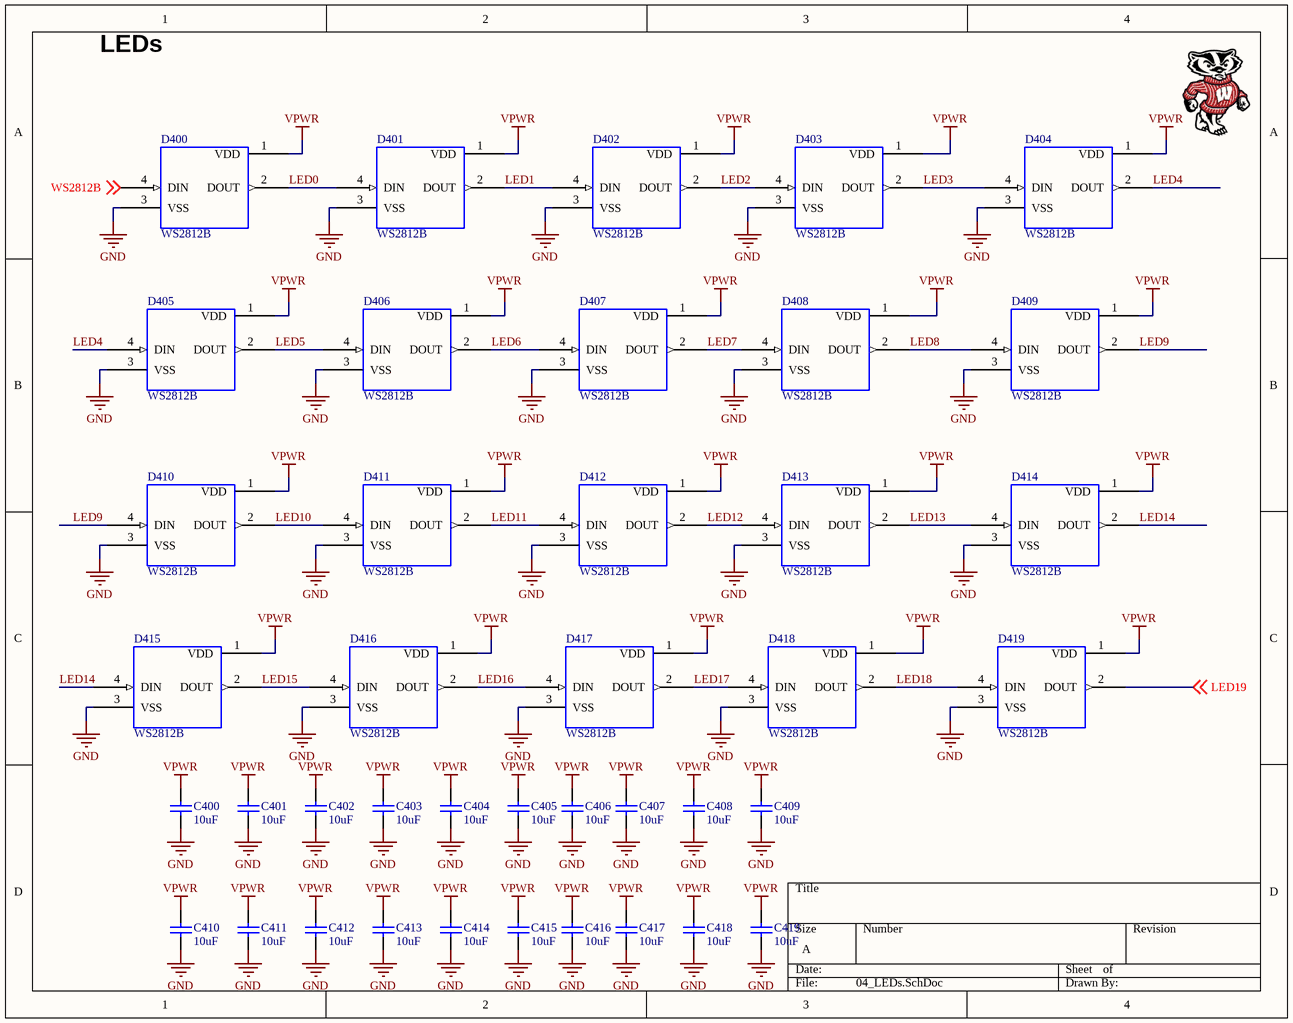
[diagram p3: 04_LEDs.SchDoc]

### Parts
C400  10uF  [CAP_0805]
C401  10uF  [CAP_0805]
C402  10uF  [CAP_0805]
C403  10uF  [CAP_0805]
C404  10uF  [CAP_0805]
C405  10uF  [CAP_0805]
C406  10uF  [CAP_0805]
C407  10uF  [CAP_0805]
C408  10uF  [CAP_0805]
C409  10uF  [CAP_0805]
C410  10uF  [CAP_0805]
C411  10uF  [CAP_0805]
C412  10uF  [CAP_0805]
C413  10uF  [CAP_0805]
C414  10uF  [CAP_0805]
C415  10uF  [CAP_0805]
C416  10uF  [CAP_0805]
C417  10uF  [CAP_0805]
C418  10uF  [CAP_0805]
C419  10uF  [CAP_0805]
D400  WS2812B  [WS2812B]
D401  WS2812B  [WS2812B]
D402  WS2812B  [WS2812B]
D403  WS2812B  [WS2812B]
D404  WS2812B  [WS2812B]
D405  WS2812B  [WS2812B]
D406  WS2812B  [WS2812B]
D407  WS2812B  [WS2812B]
D408  WS2812B  [WS2812B]
D409  WS2812B  [WS2812B]
D410  WS2812B  [WS2812B]
D411  WS2812B  [WS2812B]
D412  WS2812B  [WS2812B]
D413  WS2812B  [WS2812B]
D414  WS2812B  [WS2812B]
D415  WS2812B  [WS2812B]
D416  WS2812B  [WS2812B]
D417  WS2812B  [WS2812B]
D418  WS2812B  [WS2812B]
D419  WS2812B  [WS2812B]

### Nets
GND: C400.1 C401.1 C402.1 C403.1 C404.1 C405.1 C406.1 C407.1 C408.1 C409.1 C410.1 C411.1 C412.1 C413.1 C414.1 C415.1 C416.1 C417.1 C418.1 C419.1 D400.3(VSS) D401.3(VSS) D402.3(VSS) D403.3(VSS) D404.3(VSS) D405.3(VSS) D406.3(VSS) D407.3(VSS) D408.3(VSS) D409.3(VSS) D410.3(VSS) D411.3(VSS) D412.3(VSS) D413.3(VSS) D414.3(VSS) D415.3(VSS) D416.3(VSS) D417.3(VSS) D418.3(VSS) D419.3(VSS)
VPWR: C400.2 C401.2 C402.2 C403.2 C404.2 C405.2 C406.2 C407.2 C408.2 C409.2 C410.2 C411.2 C412.2 C413.2 C414.2 C415.2 C416.2 C417.2 C418.2 C419.2 D400.1(VDD) D401.1(VDD) D402.1(VDD) D403.1(VDD) D404.1(VDD) D405.1(VDD) D406.1(VDD) D407.1(VDD) D408.1(VDD) D409.1(VDD) D410.1(VDD) D411.1(VDD) D412.1(VDD) D413.1(VDD) D414.1(VDD) D415.1(VDD) D416.1(VDD) D417.1(VDD) D418.1(VDD) D419.1(VDD)
LED0: D400.2(DOUT) D401.4(DIN)
LED1: D401.2(DOUT) D402.4(DIN)
LED2: D402.2(DOUT) D403.4(DIN)
LED3: D403.2(DOUT) D404.4(DIN)
LED4: D404.2(DOUT) D405.4(DIN)
LED5: D405.2(DOUT) D406.4(DIN)
LED6: D406.2(DOUT) D407.4(DIN)
LED7: D407.2(DOUT) D408.4(DIN)
LED8: D408.2(DOUT) D409.4(DIN)
LED9: D409.2(DOUT) D410.4(DIN)
LED10: D410.2(DOUT) D411.4(DIN)
LED11: D411.2(DOUT) D412.4(DIN)
LED12: D412.2(DOUT) D413.4(DIN)
LED13: D413.2(DOUT) D414.4(DIN)
LED14: D414.2(DOUT) D415.4(DIN)
LED15: D415.2(DOUT) D416.4(DIN)
LED16: D416.2(DOUT) D417.4(DIN)
LED17: D417.2(DOUT) D418.4(DIN)
LED18: D418.2(DOUT) D419.4(DIN)
LED19: D419.2(DOUT) ; off-sheet LED19
WS2812B: D400.4(DIN) ; off-sheet WS2812B

### Notes on the sheet
- LEDs

### Library data of the parts
C400-C419 = CAP_0805_U_010.00: as C200 on sheet 02-Power; ComponentLink3URL: https://datasheet.ciiva.com/26920/getdatasheetpartid-355170-26920201.pdf; ComponentLink3Description: https://datasheet.ciiva.com/26920/getdatasheetpartid-355170-26920201.pdf; Supplier 1: Digi-Key; Stock 1: 40000; Pricing 1: 1=0.22, 10=0.148, 100=0.0749, 500=0.05122, 1000=0.04531 (USD); Mount: Surface Mount; Case/Package: 0805; Case Code (Metric): 2012; Case Code (Imperial): 0805; Contact Plating: Tin; Min Operating Temperature: -55°C; Max Operating Temperature: 85°C; Packaging: Tape and Reel; Package Quantity: 1; Length: 2mm; Height: 0.85mm; Width: 0.049inch; Thickness: 0.037inch; Depth: 1.25mm; Radiation Hardening: No; ComponentLink1URL: https://datasheet.ciiva.com/25730/cl21a106kpclqnc-25730594.pdf; ComponentLink1Description: https://datasheet.ciiva.com/25730/cl21a106kpclqnc-25730594.pdf; Supplier Part Number 1: 1276-2402-1-ND; Capacitance: 10uF
D400-D419 = WS2812B: LED RGB WS2812B; Manufacturer Part Number: EBAY; Rating: 3.5V-5.3V; Value: WS2812B

## Sheet 05_LEDs.SchDoc: ECE315 Analog
size A; Date: 4/25/2017; ApprovedBy: JSK; CheckedBy: JSK; Author: JSK; CompanyName: University of Wisconsin; DrawnBy: JSK; Engineer: JSK; Organization: ECE 315; Address1: College of Engineering; Address2: 1415 Engineering Drive; Address3: Madison, WI 53706; Address4: ECE 315 Fall 2017; Revision: A; SheetNumber: 2; SheetTotal: 2; AssemblyNumber: ECE315-F19; ApprovedDate: 04/02/2019
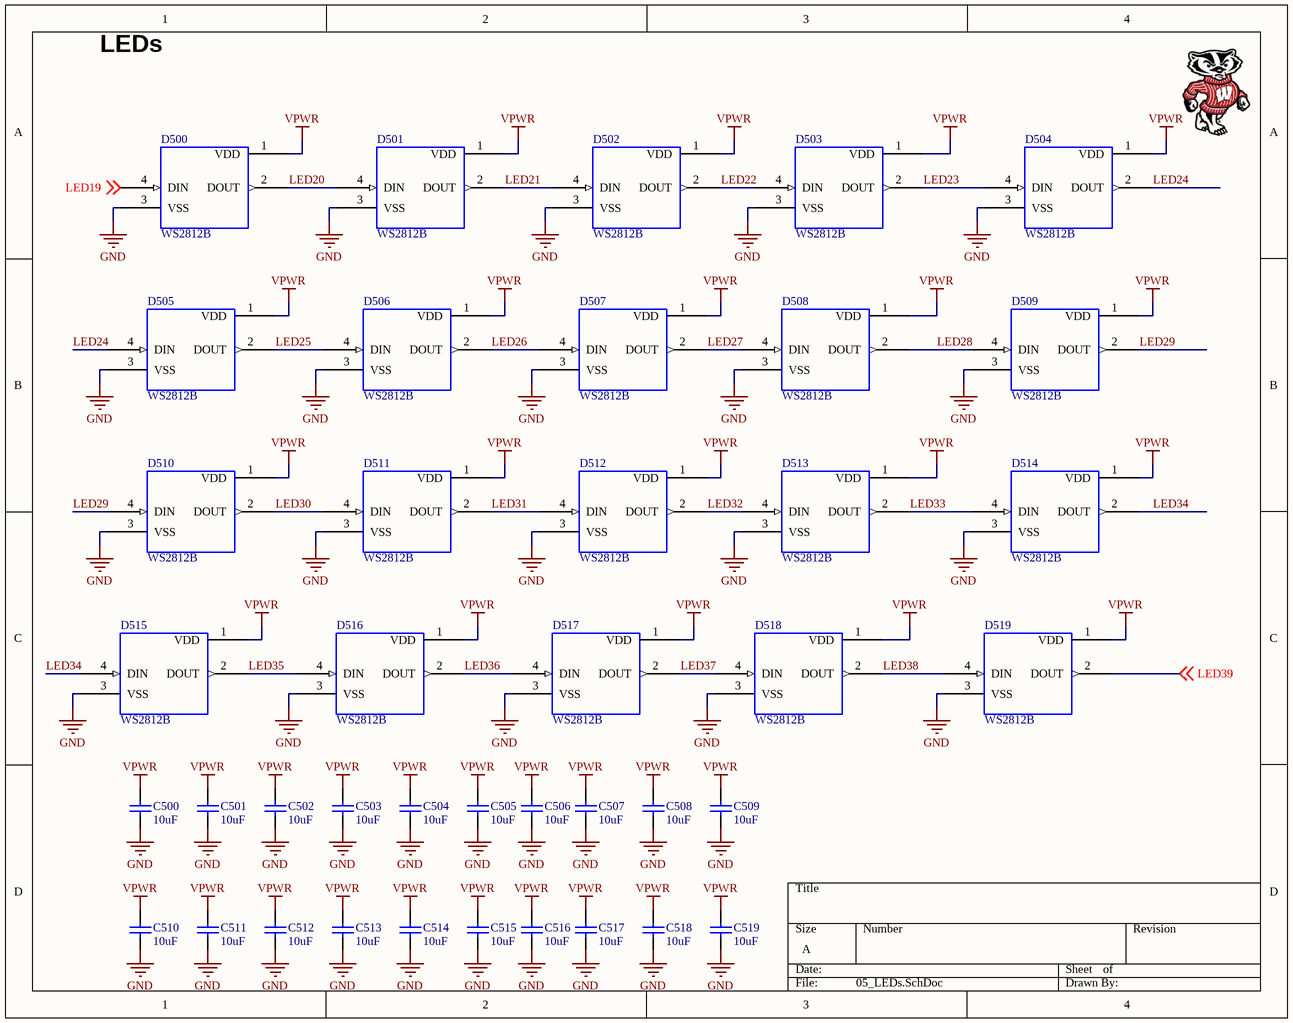
[diagram p4: 05_LEDs.SchDoc]

### Parts
C500  10uF  [CAP_0805]
C501  10uF  [CAP_0805]
C502  10uF  [CAP_0805]
C503  10uF  [CAP_0805]
C504  10uF  [CAP_0805]
C505  10uF  [CAP_0805]
C506  10uF  [CAP_0805]
C507  10uF  [CAP_0805]
C508  10uF  [CAP_0805]
C509  10uF  [CAP_0805]
C510  10uF  [CAP_0805]
C511  10uF  [CAP_0805]
C512  10uF  [CAP_0805]
C513  10uF  [CAP_0805]
C514  10uF  [CAP_0805]
C515  10uF  [CAP_0805]
C516  10uF  [CAP_0805]
C517  10uF  [CAP_0805]
C518  10uF  [CAP_0805]
C519  10uF  [CAP_0805]
D500  WS2812B  [WS2812B]
D501  WS2812B  [WS2812B]
D502  WS2812B  [WS2812B]
D503  WS2812B  [WS2812B]
D504  WS2812B  [WS2812B]
D505  WS2812B  [WS2812B]
D506  WS2812B  [WS2812B]
D507  WS2812B  [WS2812B]
D508  WS2812B  [WS2812B]
D509  WS2812B  [WS2812B]
D510  WS2812B  [WS2812B]
D511  WS2812B  [WS2812B]
D512  WS2812B  [WS2812B]
D513  WS2812B  [WS2812B]
D514  WS2812B  [WS2812B]
D515  WS2812B  [WS2812B]
D516  WS2812B  [WS2812B]
D517  WS2812B  [WS2812B]
D518  WS2812B  [WS2812B]
D519  WS2812B  [WS2812B]

### Nets
GND: C500.1 C501.1 C502.1 C503.1 C504.1 C505.1 C506.1 C507.1 C508.1 C509.1 C510.1 C511.1 C512.1 C513.1 C514.1 C515.1 C516.1 C517.1 C518.1 C519.1 D500.3(VSS) D501.3(VSS) D502.3(VSS) D503.3(VSS) D504.3(VSS) D505.3(VSS) D506.3(VSS) D507.3(VSS) D508.3(VSS) D509.3(VSS) D510.3(VSS) D511.3(VSS) D512.3(VSS) D513.3(VSS) D514.3(VSS) D515.3(VSS) D516.3(VSS) D517.3(VSS) D518.3(VSS) D519.3(VSS)
VPWR: C500.2 C501.2 C502.2 C503.2 C504.2 C505.2 C506.2 C507.2 C508.2 C509.2 C510.2 C511.2 C512.2 C513.2 C514.2 C515.2 C516.2 C517.2 C518.2 C519.2 D500.1(VDD) D501.1(VDD) D502.1(VDD) D503.1(VDD) D504.1(VDD) D505.1(VDD) D506.1(VDD) D507.1(VDD) D508.1(VDD) D509.1(VDD) D510.1(VDD) D511.1(VDD) D512.1(VDD) D513.1(VDD) D514.1(VDD) D515.1(VDD) D516.1(VDD) D517.1(VDD) D518.1(VDD) D519.1(VDD)
LED19: D500.4(DIN) ; off-sheet LED19
LED20: D500.2(DOUT) D501.4(DIN)
LED21: D501.2(DOUT) D502.4(DIN)
LED22: D502.2(DOUT) D503.4(DIN)
LED23: D503.2(DOUT) D504.4(DIN)
LED24: D504.2(DOUT) D505.4(DIN)
LED25: D505.2(DOUT) D506.4(DIN)
LED26: D506.2(DOUT) D507.4(DIN)
LED27: D507.2(DOUT) D508.4(DIN)
LED28: D508.2(DOUT) D509.4(DIN)
LED29: D509.2(DOUT) D510.4(DIN)
LED30: D510.2(DOUT) D511.4(DIN)
LED31: D511.2(DOUT) D512.4(DIN)
LED32: D512.2(DOUT) D513.4(DIN)
LED33: D513.2(DOUT) D514.4(DIN)
LED34: D514.2(DOUT) D515.4(DIN)
LED35: D515.2(DOUT) D516.4(DIN)
LED36: D516.2(DOUT) D517.4(DIN)
LED37: D517.2(DOUT) D518.4(DIN)
LED38: D518.2(DOUT) D519.4(DIN)
LED39: D519.2(DOUT) ; off-sheet LED39

### Notes on the sheet
- LEDs

### Library data of the parts
C500-C519 = CAP_0805_U_010.00: as C200 on sheet 02-Power; ComponentLink3URL: https://datasheet.ciiva.com/26920/getdatasheetpartid-355170-26920201.pdf; ComponentLink3Description: https://datasheet.ciiva.com/26920/getdatasheetpartid-355170-26920201.pdf; Supplier 1: Digi-Key; Stock 1: 40000; Pricing 1: 1=0.22, 10=0.148, 100=0.0749, 500=0.05122, 1000=0.04531 (USD); Mount: Surface Mount; Case/Package: 0805; Case Code (Metric): 2012; Case Code (Imperial): 0805; Contact Plating: Tin; Min Operating Temperature: -55°C; Max Operating Temperature: 85°C; Packaging: Tape and Reel; Package Quantity: 1; Length: 2mm; Height: 0.85mm; Width: 0.049inch; Thickness: 0.037inch; Depth: 1.25mm; Radiation Hardening: No; ComponentLink1URL: https://datasheet.ciiva.com/25730/cl21a106kpclqnc-25730594.pdf; ComponentLink1Description: https://datasheet.ciiva.com/25730/cl21a106kpclqnc-25730594.pdf; Supplier Part Number 1: 1276-2402-1-ND; Capacitance: 10uF
D500-D519 = WS2812B: as D400 on sheet 04_LEDs; Value: WS2812B

## Sheet 06_LEDs.SchDoc: ECE315 Analog
size A; Date: 4/25/2017; ApprovedBy: JSK; CheckedBy: JSK; Author: JSK; CompanyName: University of Wisconsin; DrawnBy: JSK; Engineer: JSK; Organization: ECE 315; Address1: College of Engineering; Address2: 1415 Engineering Drive; Address3: Madison, WI 53706; Address4: ECE 315 Fall 2017; Revision: A; SheetNumber: 2; SheetTotal: 2; AssemblyNumber: ECE315-F19; ApprovedDate: 04/02/2019
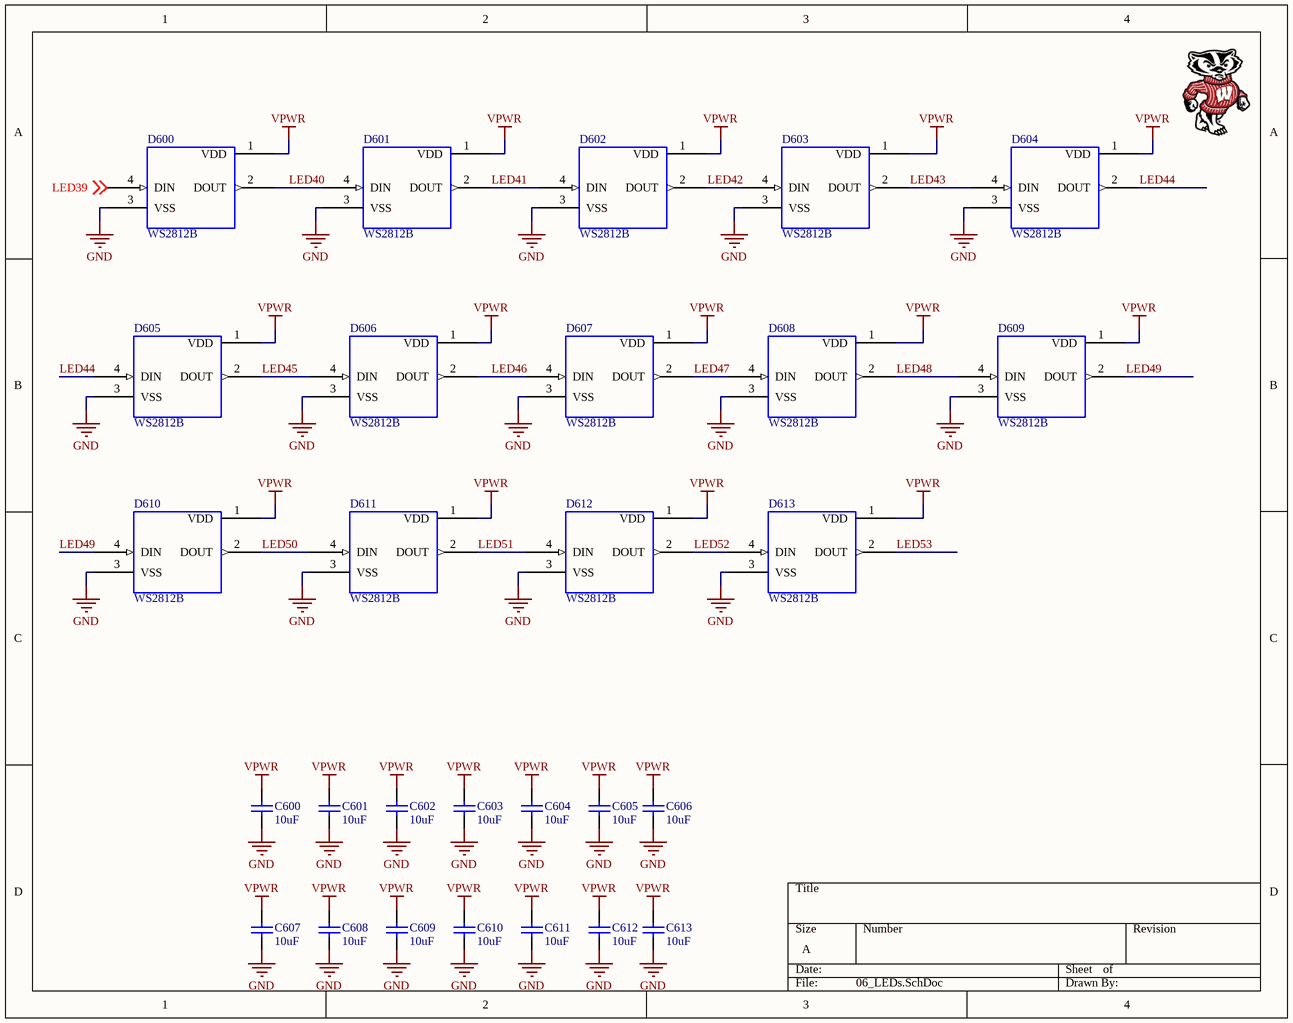
[diagram p5: 06_LEDs.SchDoc]

### Parts
C600  10uF  [CAP_0805]
C601  10uF  [CAP_0805]
C602  10uF  [CAP_0805]
C603  10uF  [CAP_0805]
C604  10uF  [CAP_0805]
C605  10uF  [CAP_0805]
C606  10uF  [CAP_0805]
C607  10uF  [CAP_0805]
C608  10uF  [CAP_0805]
C609  10uF  [CAP_0805]
C610  10uF  [CAP_0805]
C611  10uF  [CAP_0805]
C612  10uF  [CAP_0805]
C613  10uF  [CAP_0805]
D600  WS2812B  [WS2812B]
D601  WS2812B  [WS2812B]
D602  WS2812B  [WS2812B]
D603  WS2812B  [WS2812B]
D604  WS2812B  [WS2812B]
D605  WS2812B  [WS2812B]
D606  WS2812B  [WS2812B]
D607  WS2812B  [WS2812B]
D608  WS2812B  [WS2812B]
D609  WS2812B  [WS2812B]
D610  WS2812B  [WS2812B]
D611  WS2812B  [WS2812B]
D612  WS2812B  [WS2812B]
D613  WS2812B  [WS2812B]

### Nets
GND: C600.1 C601.1 C602.1 C603.1 C604.1 C605.1 C606.1 C607.1 C608.1 C609.1 C610.1 C611.1 C612.1 C613.1 D600.3(VSS) D601.3(VSS) D602.3(VSS) D603.3(VSS) D604.3(VSS) D605.3(VSS) D606.3(VSS) D607.3(VSS) D608.3(VSS) D609.3(VSS) D610.3(VSS) D611.3(VSS) D612.3(VSS) D613.3(VSS)
VPWR: C600.2 C601.2 C602.2 C603.2 C604.2 C605.2 C606.2 C607.2 C608.2 C609.2 C610.2 C611.2 C612.2 C613.2 D600.1(VDD) D601.1(VDD) D602.1(VDD) D603.1(VDD) D604.1(VDD) D605.1(VDD) D606.1(VDD) D607.1(VDD) D608.1(VDD) D609.1(VDD) D610.1(VDD) D611.1(VDD) D612.1(VDD) D613.1(VDD)
LED39: D600.4(DIN) ; off-sheet LED39
LED40: D600.2(DOUT) D601.4(DIN)
LED41: D601.2(DOUT) D602.4(DIN)
LED42: D602.2(DOUT) D603.4(DIN)
LED43: D603.2(DOUT) D604.4(DIN)
LED44: D604.2(DOUT) D605.4(DIN)
LED45: D605.2(DOUT) D606.4(DIN)
LED46: D606.2(DOUT) D607.4(DIN)
LED47: D607.2(DOUT) D608.4(DIN)
LED48: D608.2(DOUT) D609.4(DIN)
LED49: D609.2(DOUT) D610.4(DIN)
LED50: D610.2(DOUT) D611.4(DIN)
LED51: D611.2(DOUT) D612.4(DIN)
LED52: D612.2(DOUT) D613.4(DIN)
LED53: D613.2(DOUT)

### Library data of the parts
C600-C613 = CAP_0805_U_010.00: as C200 on sheet 02-Power; ComponentLink3URL: https://datasheet.ciiva.com/26920/getdatasheetpartid-355170-26920201.pdf; ComponentLink3Description: https://datasheet.ciiva.com/26920/getdatasheetpartid-355170-26920201.pdf; Supplier 1: Digi-Key; Stock 1: 40000; Pricing 1: 1=0.22, 10=0.148, 100=0.0749, 500=0.05122, 1000=0.04531 (USD); Mount: Surface Mount; Case/Package: 0805; Case Code (Metric): 2012; Case Code (Imperial): 0805; Contact Plating: Tin; Min Operating Temperature: -55°C; Max Operating Temperature: 85°C; Packaging: Tape and Reel; Package Quantity: 1; Length: 2mm; Height: 0.85mm; Width: 0.049inch; Thickness: 0.037inch; Depth: 1.25mm; Radiation Hardening: No; ComponentLink1URL: https://datasheet.ciiva.com/25730/cl21a106kpclqnc-25730594.pdf; ComponentLink1Description: https://datasheet.ciiva.com/25730/cl21a106kpclqnc-25730594.pdf; Supplier Part Number 1: 1276-2402-1-ND; Capacitance: 10uF
D600-D613 = WS2812B: as D400 on sheet 04_LEDs; Value: WS2812B

## Sheet 07_Buzzer.SchDoc: ECE315 Analog
size A; Date: 4/25/2017; ApprovedBy: JSK; CheckedBy: JSK; Author: JSK; CompanyName: University of Wisconsin; DrawnBy: JSK; Engineer: JSK; Organization: ECE 315; Address1: College of Engineering; Address2: 1415 Engineering Drive; Address3: Madison, WI 53706; Address4: ECE 315 Fall 2017; Revision: A; SheetNumber: 2; SheetTotal: 2; AssemblyNumber: ECE315-F19; ApprovedDate: 04/02/2019
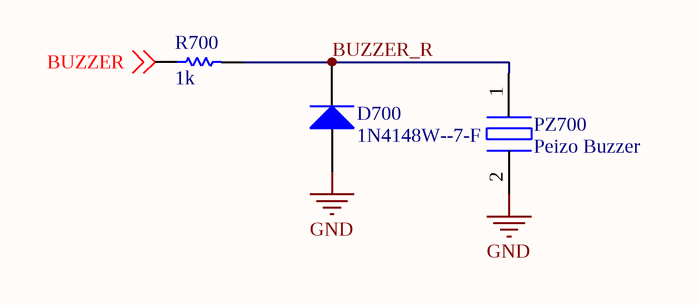
[diagram p6: 07_Buzzer.SchDoc]

### Parts
D700  Manufacturer Part Number: 1N4148W--7-F  [SOD323-12]  (hidden comment: DIODE_4148)
PZ700  Peizo Buzzer  [PKLCS]
R700  Resistance (Ohms): 1k  [RES_0805]  (hidden comment: RES_0805_K_001.00)

### Nets
GND: D700.2(A) PZ700.2(In)
BUZZER: R700.1 ; off-sheet BUZZER
BUZZER_R: D700.1(K) PZ700.1(In) R700.2

### Library data of the parts
D700 = DIODE_4148: DIODE GEN PURP 100V 300MA SOD123; Manufacturer: Diodes; Diode Configuration: Single; Number of Elements per Chip: 1; Maximum Forward Voltage: 1.25V; Supplier 1: Digi-Key; Stock 1: 993734; Pricing 1: 1=0.18, 10=0.164, 100=0.0891, 500=0.0548, 1000=0.0374 (USD); Mounting Type: Surface Mount; Maximum Reverse Voltage: 100V; Package Type: SOD-123; Pin Count: 2; ComponentLink1URL: http://uk.rs-online.com/webdocs/0f8c/0900766b80f8c94e.pdf; ComponentLink1Description: http://uk.rs-online.com/webdocs/0f8c/0900766b80f8c94e.pdf; Supplier Part Number 1: 1N4148W-FDICT-ND
PZ700 = Peizo: AUDIO PIEZO TRANSDUCER 12.5V SMD; Manufacturer Part Number: PKLCS1212E2000-R1; Manufacturer: Murata Electronics North America; Voltage Range: 12.5V (Max); Sound Pressure Level: 70dB @ 1.5V, 10cm; Input Type: Zero-Peak Signal; Voltage - Rated: 1.5V; Driver Circuitry: Transducer, Externally Driven; Port Location: Side; Frequency: 2kHz; Operating Mode: Single Tone; Supplier: Digi-Key; RoHS: RoHS Compliant; Mounting Type: Surface Mount; Category: Audio Products; Termination: Solder Pads; Operating Temperature: -20°C ~ 70°C; Size / Dimension: 12.0mm L x 12.0mm W x 3.0mm H; Packaging: Cut Tape (CT); Technology: Piezo; Supplier Part Number: 490-5260-1-ND
R700 = RES_0805_K_001.00: RES SMD 1K OHM 1% 1/8W 0805; Manufacturer Part Number: ERJ-6ENF1001V; Manufacturer: Panasonic Electronic Components; Temperature Coefficient: ±100ppm/°C; Power (Watts): 0.125W, 1/8W; Failure Rate: -; Category: Resistors; Operating Temperature: -55°C ~ 155°C; RoHS: RoHS Compliant; Height - Seated (Max): 0.028" (0.70mm); Package / Case: 0805 (2012 Metric); Part Status: Active; Supplier: Digi-Key; Size / Dimension: 0.079" L x 0.049" W (2.00mm x 1.25mm); Composition: Thick Film; Features: Automotive AEC-Q200; Number of Terminations: 2; Tolerance: ±1%; Packaging: Cut Tape (CT); Supplier Device Package: 0805; Supplier Part Number: P1.00KCCT-ND

## Sheet 08_USB_To_UART.SchDoc
size A; ApprovedDate: 04/02/2019; AssemblyNumber: ECE315-F19
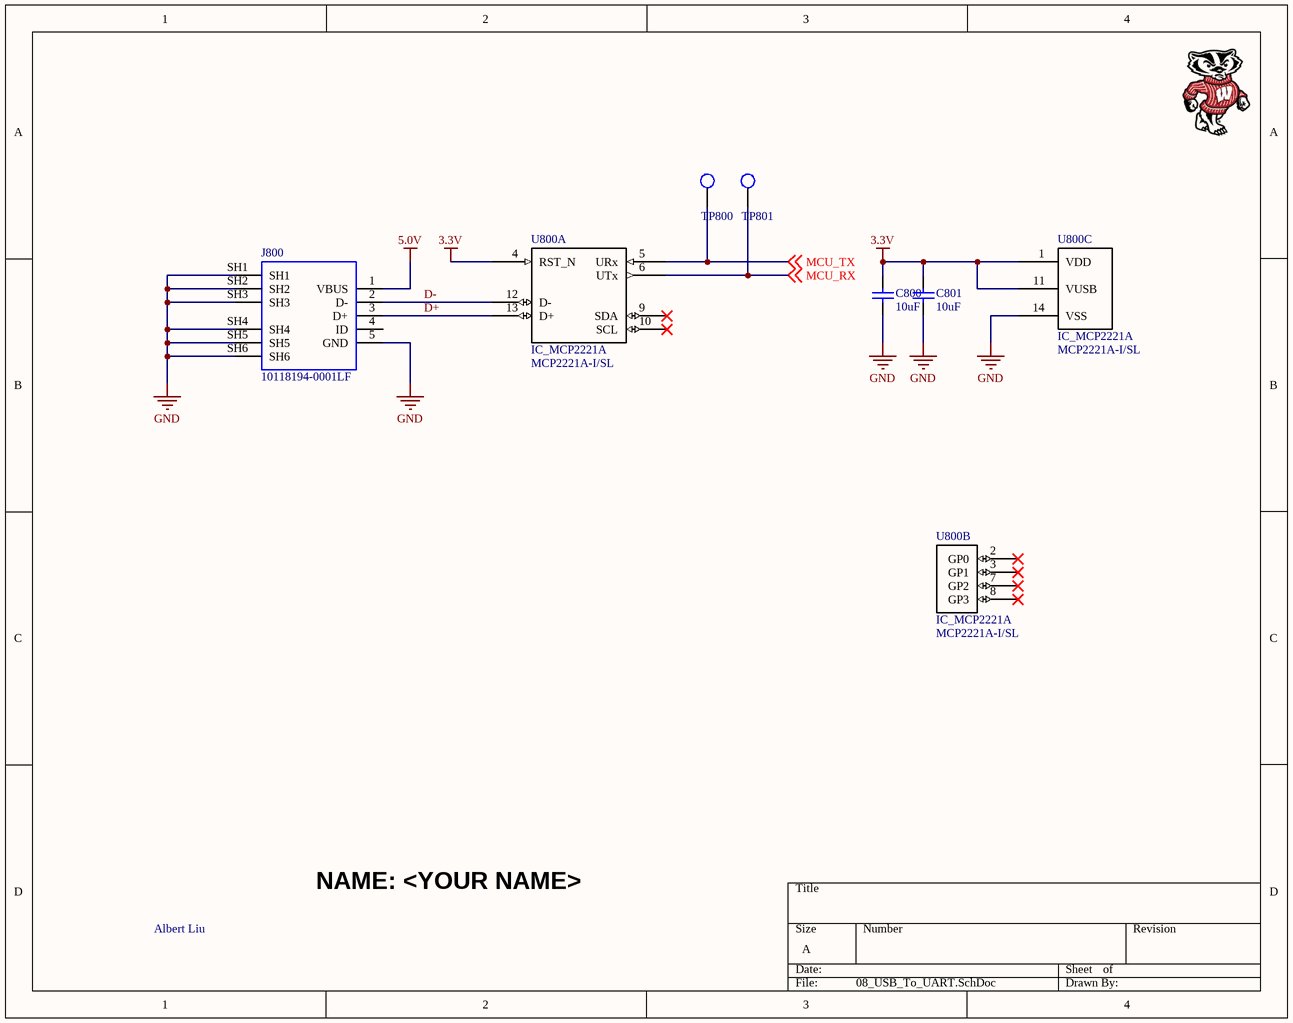
[diagram p7: 08_USB_To_UART.SchDoc]

### Parts
C800  10uF  [CAP_0805]
C801  10uF  [CAP_0805]
J800  Manufacturer Part Number: 10118194-0001LF  [USB_MICRO_B]  (hidden comment: USB_MICRO_B_10118194-0001LF)
TP800  TP_1206  [TP-SMC-1206]  (value not drawn)
TP801  TP_1206  [TP-SMC-1206]  (value not drawn)
U800  IC_MCP2221A  Manufacturer Part Number: MCP2221A-I/SL  [IC_MCP2221A]  (parts A,B,C of 3)

### Nets
3.3V: C800.2 C801.2 U800.1(VDD) U800.4(RST_N) U800.11(VUSB)
5.0V: J800.1(VBUS)
GND: C800.1 C801.1 J800.5(GND) J800.SH1 J800.SH2 J800.SH3 J800.SH4 J800.SH5 J800.SH6 U800.14(VSS)
D+: J800.3(D+) U800.13(D+)
D-: J800.2(D-) U800.12(D-)
MCU_RX: TP801.1 U800.6(UTx) ; off-sheet MCU_RX
MCU_TX: TP800.1 U800.5(URx) ; off-sheet MCU_TX

Not connected (* = marked no-connect by the designer): J800 4(ID); U800 2(GP0)* 3(GP1)* 7(GP2)* 8(GP3)* 9(SDA)* 10(SCL)*

### Notes on the sheet
- NAME: <YOUR NAME>
- Albert Liu

### Library data of the parts
C800 C801 = CAP_0805_U_010.00: as C200 on sheet 02-Power; ComponentLink3URL: https://datasheet.ciiva.com/26920/getdatasheetpartid-355170-26920201.pdf; ComponentLink3Description: https://datasheet.ciiva.com/26920/getdatasheetpartid-355170-26920201.pdf; Supplier 1: Digi-Key; Stock 1: 40000; Pricing 1: 1=0.22, 10=0.148, 100=0.0749, 500=0.05122, 1000=0.04531 (USD); Mount: Surface Mount; Case/Package: 0805; Case Code (Metric): 2012; Case Code (Imperial): 0805; Contact Plating: Tin; Min Operating Temperature: -55°C; Max Operating Temperature: 85°C; Packaging: Tape and Reel; Package Quantity: 1; Length: 2mm; Height: 0.85mm; Width: 0.049inch; Thickness: 0.037inch; Depth: 1.25mm; Radiation Hardening: No; ComponentLink1URL: https://datasheet.ciiva.com/25730/cl21a106kpclqnc-25730594.pdf; ComponentLink1Description: https://datasheet.ciiva.com/25730/cl21a106kpclqnc-25730594.pdf; Supplier Part Number 1: 1276-2402-1-ND; Capacitance: 10uF
J800 = USB_MICRO_B_10118194-0001LF: CONN USB MICRO B RECPT SMT R/A; Manufacturer: Amphenol FCI; Pitch: 0.65mm; Connector Type: USB,Receptacle; Insulation Resistance: 1GR; Number of Contacts: 5; Number of Ports: 1; Current Rating: 1.8A; Gender: Receptacle; Max Voltage Rating (AC): 100V; Orientation: Right Angle; Depth: 5mm; Length: 8.05mm; Package Quantity: 9600; Supplier: Digi-Key; Max Operating Temperature: 85°C; Flammability Rating: UL94 V-0; Packaging: Tape and Reel; Color: Black; Mount: Surface Mount,Horizontal; Lead Free: Lead Free; Number of Terminals: 5; Housing Material: Polymer; Features: Shielded; Termination: Solder; Min Operating Temperature: -55°C; Contact Plating: Gold; Contact Material: Copper Alloy; Radiation Hardening: No; Supplier Part Number: 609-4618-1-ND
TP800 TP801 = TP_1206: as TP200 on sheet 02-Power; Supplier 1: Digi-Key; Stock 1: 31937; Pricing 1: 1=0.28, 10=0.261, 25=0.224, 50=0.1902, 100=0.1828, 250=0.1641, 500=0.1567, 1000=0.1306 (USD); Case Size: 1206; Dimension: 3.2 x 1.6 x 1.25mm; Family: RC; Mounting: Surface Mount; Operating Temperature: -55 to 125 C; Part No: 1625854-1; RoHS: Yes; Packaging: Tape and Reel; Termination Style: N/R; Terminal Pitch: N/R; Power Rating: N/R; Tolerance: N/R; ComponentLink1URL: https://datasheet.ciiva.com/6439/eng-ds-1773266-a-6439169.pdf; ComponentLink1Description: https://datasheet.ciiva.com/6439/eng-ds-1773266-a-6439169.pdf; ComponentLink2URL: https://datasheet.ciiva.com/30136/1773266-a-30136341.pdf; ComponentLink2Description: https://datasheet.ciiva.com/30136/1773266-a-30136341.pdf; ComponentLink3URL: https://datasheet.ciiva.com/6439/eng-ds-1773266-a-6439080.pdf; ComponentLink3Description: https://datasheet.ciiva.com/6439/eng-ds-1773266-a-6439080.pdf; ComponentLink4URL: https://datasheet.ciiva.com/6439/eng-ds-1773266-a-6439081.pdf; ComponentLink4Description: https://datasheet.ciiva.com/6439/eng-ds-1773266-a-6439081.pdf; ComponentLink5URL: https://datasheet.ciiva.com/6439/eng-ds-1773266-a-6439083.pdf; ComponentLink5Description: https://datasheet.ciiva.com/6439/eng-ds-1773266-a-6439083.pdf; Supplier Part Number 1: A106143CT-ND
U800 = IC_MCP2221A: IC USB TO I2C/UART 14SOIC; Manufacturer: Microchip; Interface: I2C,UART; Operating Supply Current: 13mA; Supplier 1: Digi-Key; Stock 1: 1104; Pricing 1: 1=1.95, 25=1.6276, 100=1.4832 (USD); Case/Package: SOIC; Min Operating Temperature: -40°C; Max Operating Temperature: 85°C; Packaging: Rail/Tube; Supplier Part Number 1: MCP2221A-I/SL-ND

## Sheet 09_Mechanicals.SchDoc
size A; ApprovedDate: 04/02/2019; AssemblyNumber: ECE315-F19
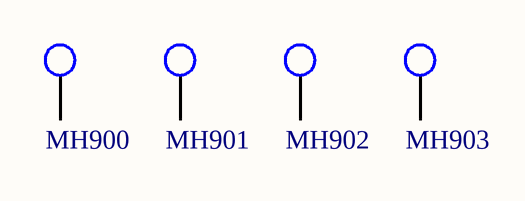
[diagram p8: 09_Mechanicals.SchDoc]

### Parts
MH900  MHOLE_2_55MM  [MHOLE_2_55MM]  (value not drawn)  (no BOM)
MH901  MHOLE_2_55MM  [MHOLE_2_55MM]  (value not drawn)  (no BOM)
MH902  MHOLE_2_55MM  [MHOLE_2_55MM]  (value not drawn)  (no BOM)
MH903  MHOLE_2_55MM  [MHOLE_2_55MM]  (value not drawn)  (no BOM)

### Nets

Not connected (* = marked no-connect by the designer): MH900 1; MH901 1; MH902 1; MH903 1

### Library data of the parts
MH900-MH903 = MHOLE_2_55MM: Mounting Holde; Manufacturer Part Number: UW MTHOLE

## Nets that join several sheets
3.3V: 02-Power (C201.2 TP203.1 U200.5), 03_MCU (9 pins), 08_USB_To_UART (5 pins)
5.0V: 02-Power (S200.1 S200.4 TP201.1 U200.3), 08_USB_To_UART (J800.1)
GND: 02-Power (7 pins), 03_MCU (14 pins), 04_LEDs (40 pins), 05_LEDs (40 pins), 06_LEDs (28 pins), 07_Buzzer (D700.2 PZ700.2), 08_USB_To_UART (10 pins)
VPWR: 02-Power (C200.2 L200.2 TP200.1 U200.1), 04_LEDs (40 pins), 05_LEDs (40 pins), 06_LEDs (28 pins)
BUZZER: 03_MCU (U300.21), 07_Buzzer (R700.1)
LED19: 04_LEDs (D419.2), 05_LEDs (D500.4)
LED39: 05_LEDs (D519.2), 06_LEDs (D600.4)
MCU_RX: 03_MCU (U300.20), 08_USB_To_UART (TP801.1 U800.6)
MCU_TX: 03_MCU (U300.19), 08_USB_To_UART (TP800.1 U800.5)
WS2812B: 03_MCU (U300.13), 04_LEDs (D400.4)